# Altium project PCB_Project.PrjPcb
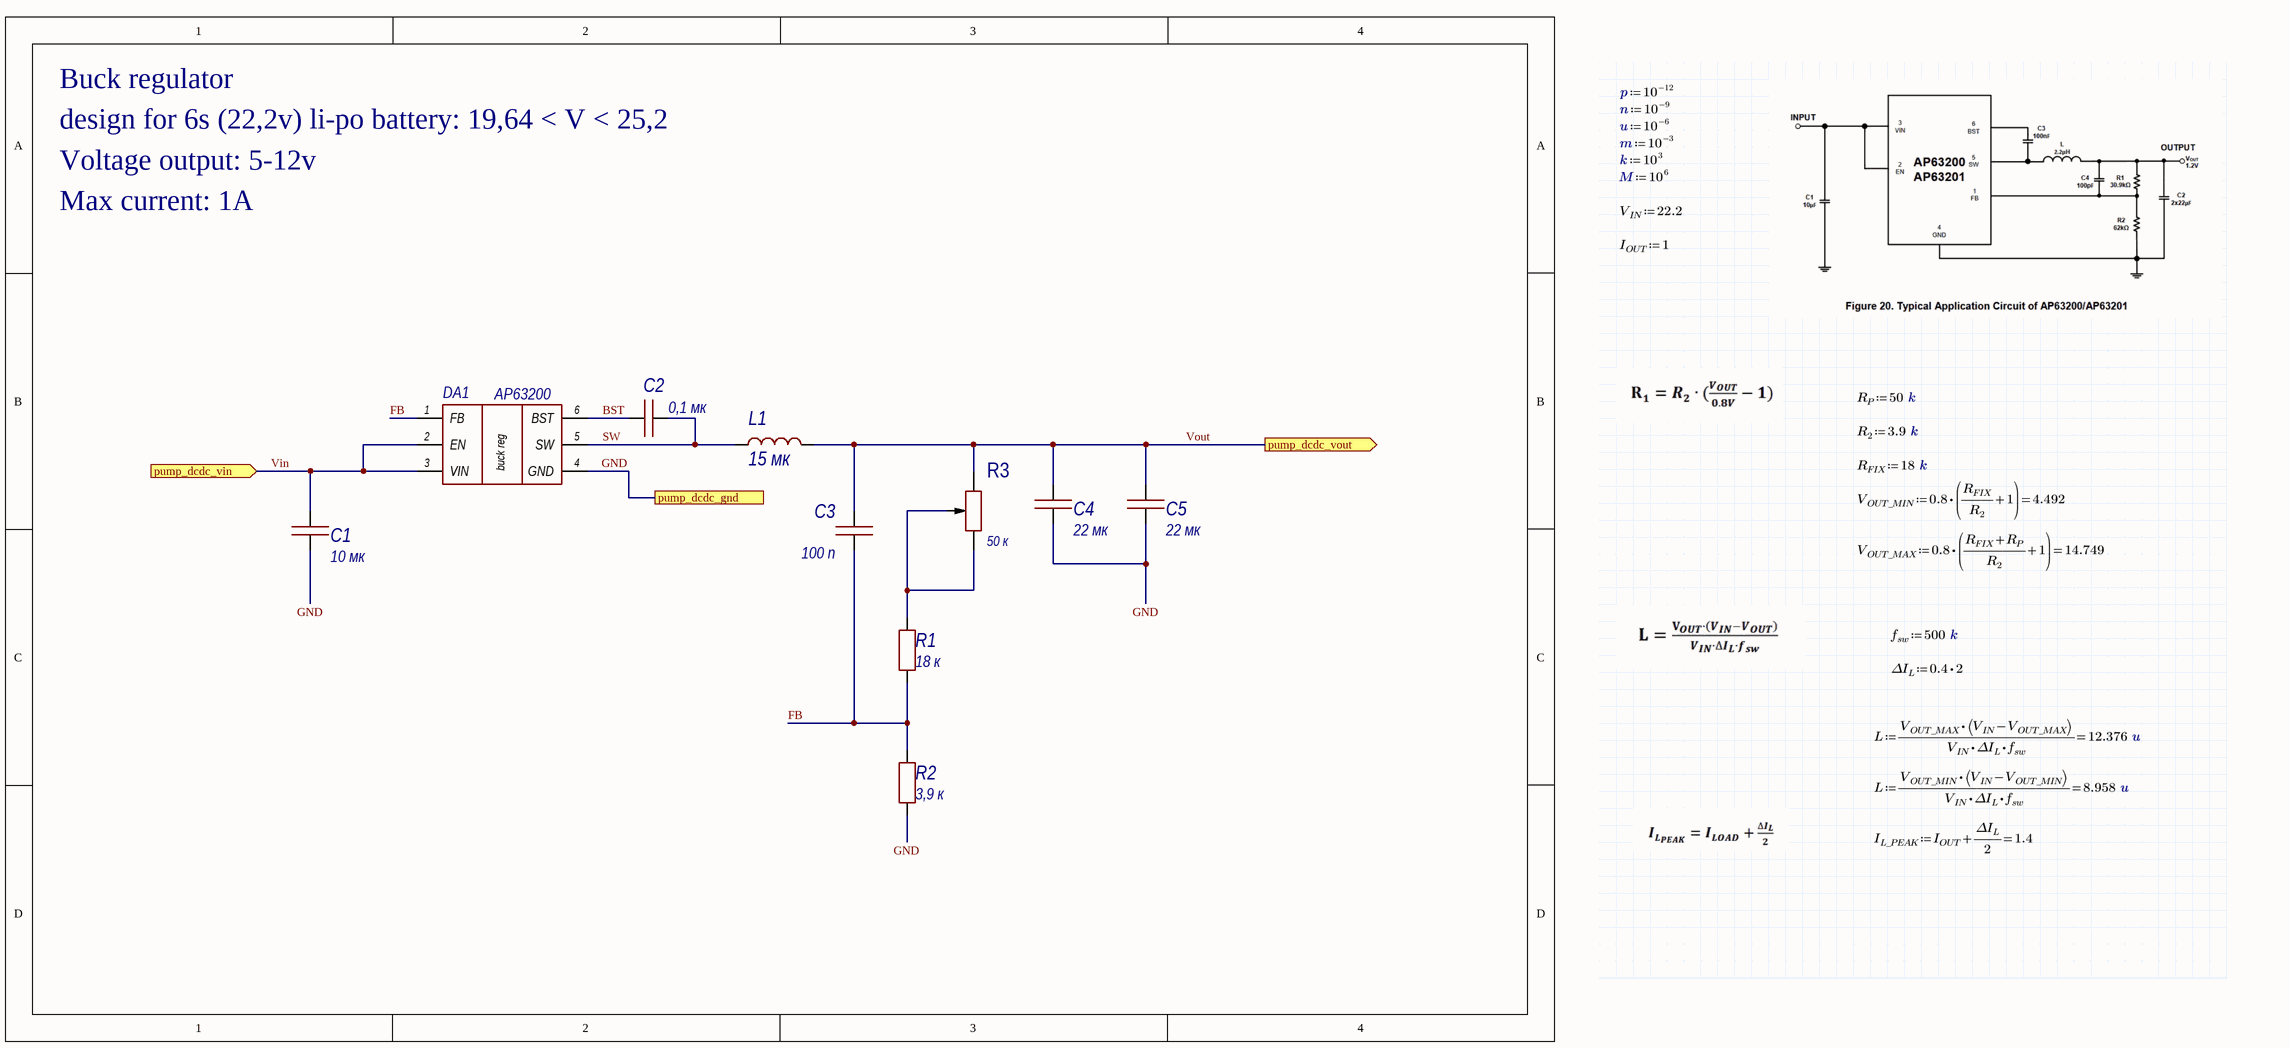
[diagram p0: low_current_buck_reg.SchDoc]
1 sheet, 10 parts. Net scope: flat (ports and power ports of the same name join across sheets).
Board file: PCB1.PcbDoc

## Sheet low_current_buck_reg.SchDoc
size A4; SheetNumber: 1; SheetTotal: 1

### Parts
C1  value 10 мк  [1210C]  (hidden comment: Capacitor)
C2  value 0,1 мк  [0603C]  (hidden comment: Capacitor)
C3  value 100 п  [0603C]  (hidden comment: Capacitor)
C4  value 22 мк  [1210C]  (hidden comment: Capacitor)
C5  value 22 мк  [1210C]  (hidden comment: Capacitor)
DA1  AP63200  [TSOT26]
L1  value 15 мк  [SP43]  (hidden comment: SP43-150K)
R1  value 18 к  [0603R]  (hidden comment: Resistor)
R2  value 3,9 к  [0603R]  (hidden comment: Resistor)
R3  value 50 к  [3mm_trim]  (hidden comment: TC33X-2-503E)

### Ports
pump_dcdc_gnd, pump_dcdc_vin (in), pump_dcdc_vout (out)

### Nets
BST: C2.1 DA1.6(BST)
FB: C3.1 DA1.1(FB) R1.1 R2.2
GND: C1.1 C4.1 C5.1 DA1.4(GND) R2.1 ; port pump_dcdc_gnd
SW: C2.2 DA1.5(SW) L1.1
Vin: C1.2 DA1.2(EN) DA1.3(VIN) ; port pump_dcdc_vin
Vout: C3.2 C4.2 C5.2 L1.2 R3.3 ; port pump_dcdc_vout
NetR1_2: R1.2 R3.1 R3.2

### Notes on the sheet
- Buck regulator
- design for 6s (22,2v) li-po battery: 19,64 < V < 25,2
- Voltage output: 5-12v
- Max current: 1A
- (in symbol AP63200) buck reg

### Library data of the parts
C1 = Capacitor_10u_10_35V_X7R_1210C: Конденсатор; Library Path2: Schematic\Capacitor.SchLib; Tolerance: 0,1; Voltage (V): 35; Dielectric: X7R; Capacity (nF): 10000; Part Number: Capacitor_10u_10_35V_X7R_1210C
C2 = Capacitor_0,1u_10_50V_X7R_0603C: Конденсатор; Library Path2: Schematic\Capacitor.SchLib; Tolerance: 0,1; Voltage (V): 50; Dielectric: X7R; Capacity (nF): 100; Part Number: Capacitor_0,1u_10_50V_X7R_0603C
C3 = Capacitor_100p_10_50V_X7R_0603C: Конденсатор; Library Path2: Schematic\Capacitor.SchLib; Tolerance: 0,1; Voltage (V): 50; Dielectric: X7R; Part Number: Capacitor_100p_10_50V_X7R_0603C; Capacity (nF): 0,1
C4 C5 = Capacitor_22u_10_25V_X7R_1210C: Конденсатор; Library Path2: Schematic\Capacitor.SchLib; Tolerance: 0,1; Voltage (V): 25; Dielectric: X7R; Capacity (nF): 22000; Part Number: Capacitor_22u_10_25V_X7R_1210C
DA1 = AP63200: DC-DC понижающий преобразователь, Vin: 3.8 - 40 В, adj, 2 А; Part Number: AP63200
L1 = SP43-150K: Индуктивность на 15 мкГн, номинальный ток 1,3 А; Inductance (μH): 15; Current (A): 1,3; Part Number: SP43-150K
R1 = Resistor_18k_1_0603: Резистор номиналом 18 кОм и точностью 1%; Power: *; Part Number: Resistor_18k_1_0603; Tolerance: 1%
R2 = Resistor_3.9k_1_0603: Резистор номиналом 3,9 кОм и точностью 1%; Power: *; Part Number: Resistor_3.9k_1_0603; Tolerance: 1%
R3 = TC33X-2-503E: Потенциометр однооборотный керметный 50кОм 0.1Вт ±25% SMD лента на катушке; Tolerance: 50%; Part Number: TC33X-2-503E